# EAGLE design NGIMU Analogue Breakout (EAGLE 7.5.0)
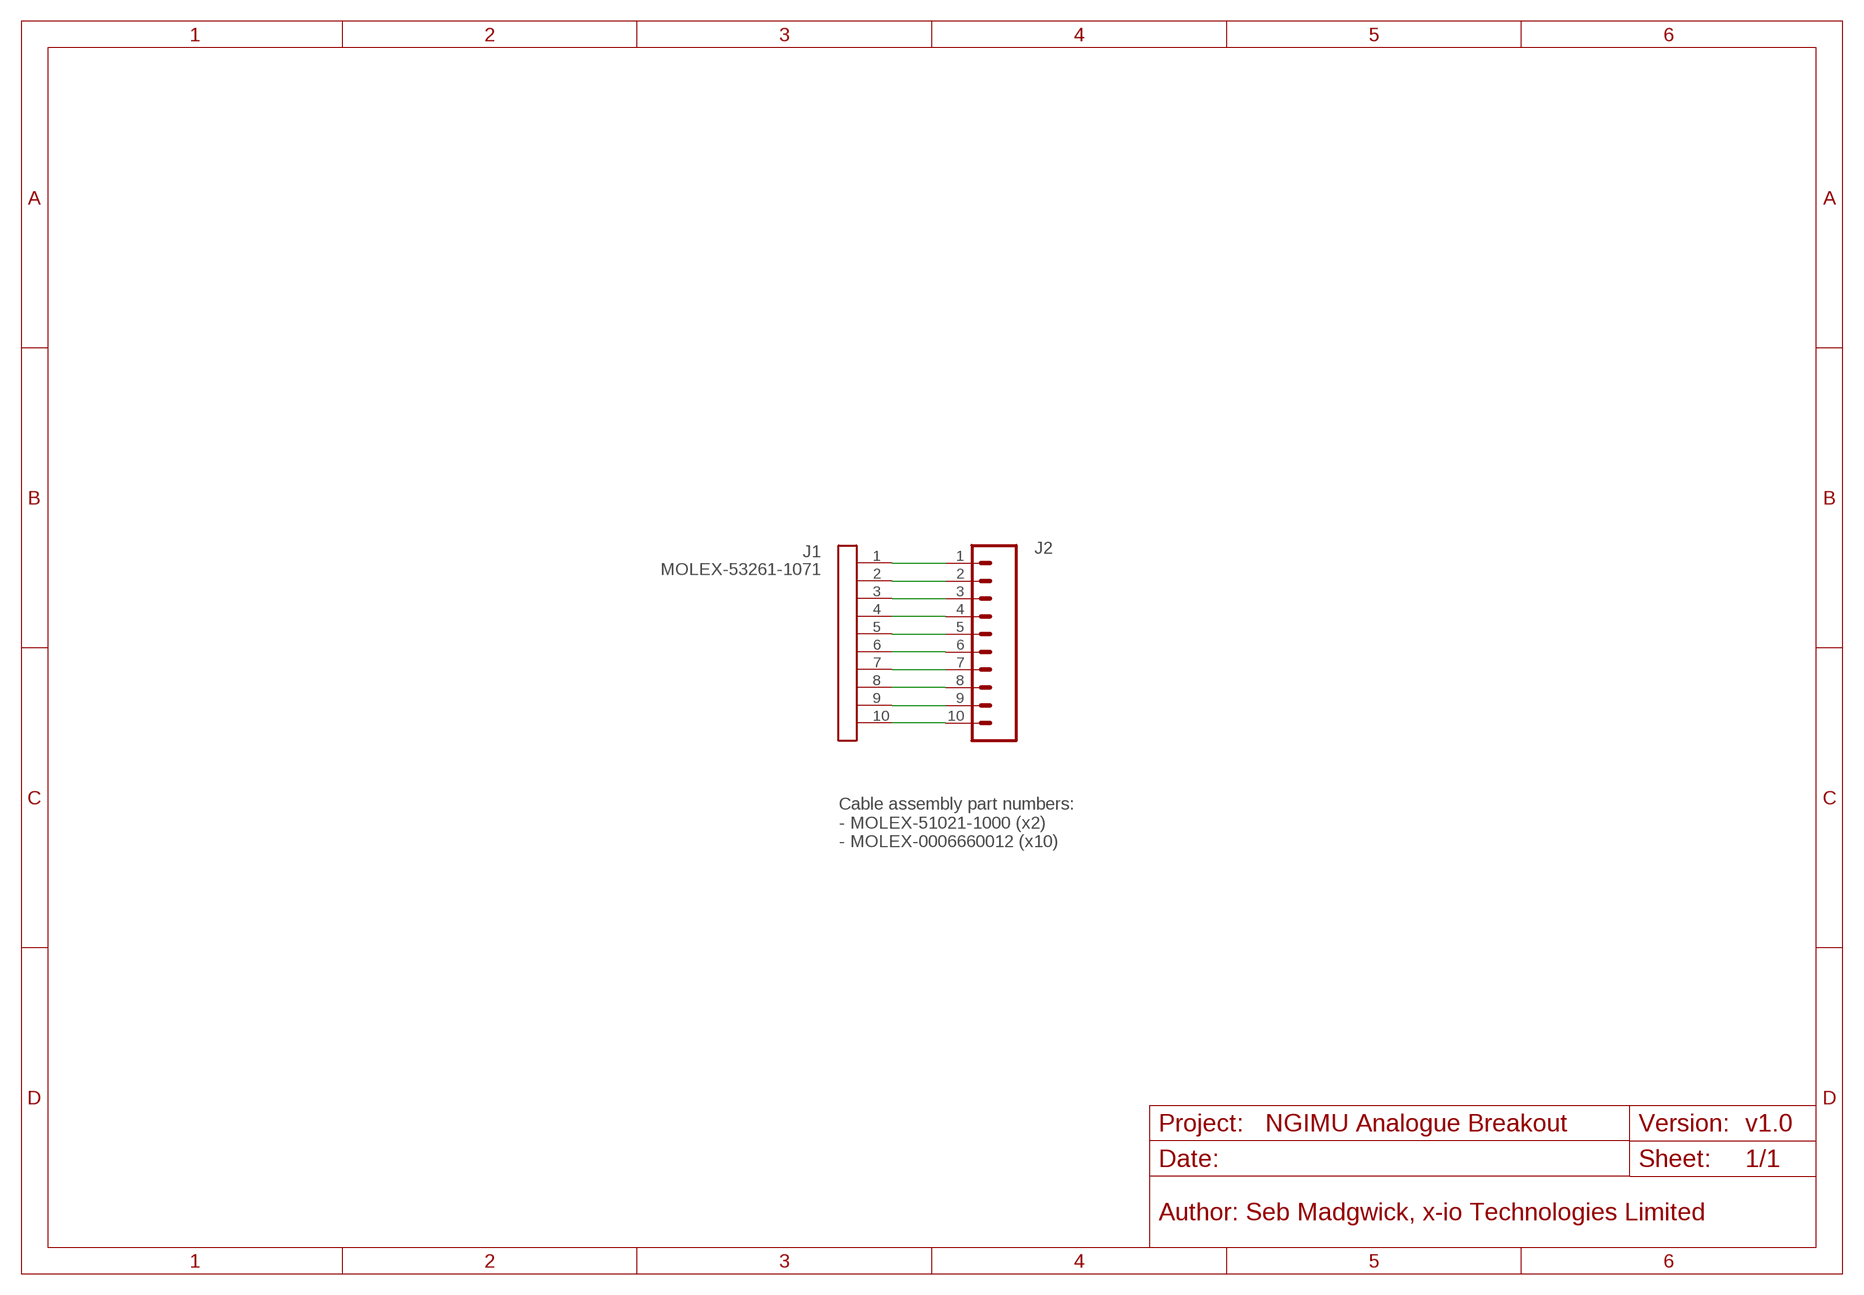
[diagram p0: schematic, sheet 1]

## Parts
J1  MOLEX-53261-1071  [MOLEX-53261-1071]
J2  M10NO_SILK_PTH_FEMALE  [1X10_NO_SILK]

## Nets
J2: J1.5 J2.5
N$1: J1.1 J2.1
N$2: J1.2 J2.2
N$3: J1.3 J2.3
N$4: J1.4 J2.4
N$6: J1.6 J2.6
N$7: J1.7 J2.7
N$8: J1.8 J2.8
N$9: J1.9 J2.9
N$10: J1.10 J2.10

## Notes on the sheet
- Cable assembly part numbers:
  - MOLEX-51021-1000 (x2)
  - MOLEX-0006660012 (x10)
- v1.0
- Author: Seb Madgwick, x-io Technologies Limited

## Library data of the parts
J1 = x-io:MOLEX-53261-1071
J2 = SparkFun-Connectors:M10: Header 10 Standard 10-pin 0.1" header. Use with straight break away headers (SKU : PRT-00116), right angle break away headers (PRT-00553), swiss pins (PRT-00743), machine pins (PRT-00117), and female headers (PRT-00115).; PROD_ID: CONN-11563

## Board
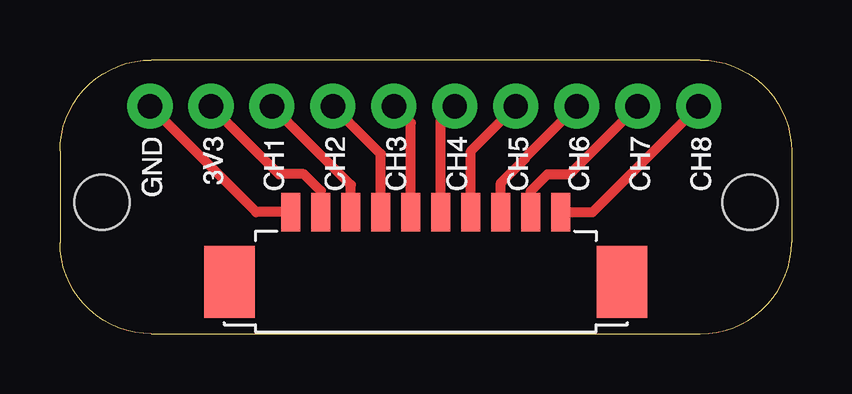
[diagram p1: board, top side]

Size 30.48 x 11.43 mm. Coordinates in mm from the lower left corner, seen from the top.
Outline: 3.81,0 26.67,0 arc90 30.48,3.81 30.48,7.62 arc90 26.67,11.43 3.81,11.43 arc90 0,7.62 0,3.81 arc90 3.81,0
Copper layers (1*16): Top 0.035mm / dielectric 1.5mm / Bottom 0.035mm
Design rules "default *": minimum track width 6mil, minimum drill 13mil, track to track 6mil, track to pad 6mil, pad to pad 6mil, via to via 6mil, smd to smd 6mil, copper to edge 15mil, drill to drill 13mil, minimum pad ring 10mil, minimum via ring 8mil, stop-mask expansion 4mil, vias tented up to drill 0mil, thermal gap 10mil
Holes 2.3 mm at 28.75,5.5 1.75,5.5

### Footprints (pad centres in the part's own frame; a part is rotated, then mirrored left to right if it is on the bottom)
MOLEX-53261-1071 = smd 0.8 x 1.6: 1 -5.625,0; 2 -4.375,0; 3 -3.125,0; 4 -1.875,0; 5 -0.625,0; 6 0.625,0; 7 1.875,0; 8 3.125,0; 9 4.375,0; 10 5.625,0 | smd 2.1 x 3: FITTING_NAIL1 -8.175,-2.9; FITTING_NAIL2 8.175,-2.9
1X10_NO_SILK = drill 1.016 pad 1.88: 1 0,0; 2 2.54,0; 3 5.08,0; 4 7.62,0; 5 10.16,0; 6 12.7,0; 7 15.24,0; 8 17.78,0; 9 20.32,0; 10 22.86,0

### Placement (x,y rotation side)
J1  15.24,5.08 0 top
J2  3.75,9.5 0 top
U$1  [NGIMU_ANALOGUE_BREAKOUT_V1.0_BOTTOM]  0,0 0 top
U$2  [NGIMU_ANALOGUE_BREAKOUT_V1.0_TOP]  0,0 0 top

### Tracks (layer width: path | path; a pad name or v marks a point on that pad's centre or on a via)
J2
  Top 0.406: J1.5 14.62,8.79 J2.5
N$1
  Top 0.406: J1.1 8.17,5.08 J2.1
N$2
  Top 0.406: J1.2 10.87,5.96 10.16,6.67 9.12,6.67 J2.2
N$3
  Top 0.406: J1.3 12.12,6.21 J2.3
N$4
  Top 0.406: J1.4 13.37,7.5 J2.4
N$6
  Top 0.406: J1.6 15.87,8.91 J2.6
N$7
  Top 0.406: J1.7 17.11,7.62 J2.7
N$8
  Top 0.406: J1.8 18.36,6.3 19.37,7.3 19.37,7.34 J2.8
N$9
  Top 0.406: J1.9 19.61,5.96 20.32,6.67 21.24,6.67 J2.9
N$10
  Top 0.406: J1.10 22.19,5.08 J2.10

### Text on the board
tUnrenderedSilk: GND | 3V3 | CH1 | CH2 | CH3 | CH4 | CH5 | CH6 | CH7 | CH8
bUnrenderedSilk: Ground | 3.3V Out | Channel 1 | Channel 2 | Channel 3 | Channel 4 | Channel 5 | Channel 6 | Channel 7 | Channel 8 | 27 mm | 2.3 mm